# EAGLE design Arcade Kitchen Timer Mini (EAGLE 8.4.1)
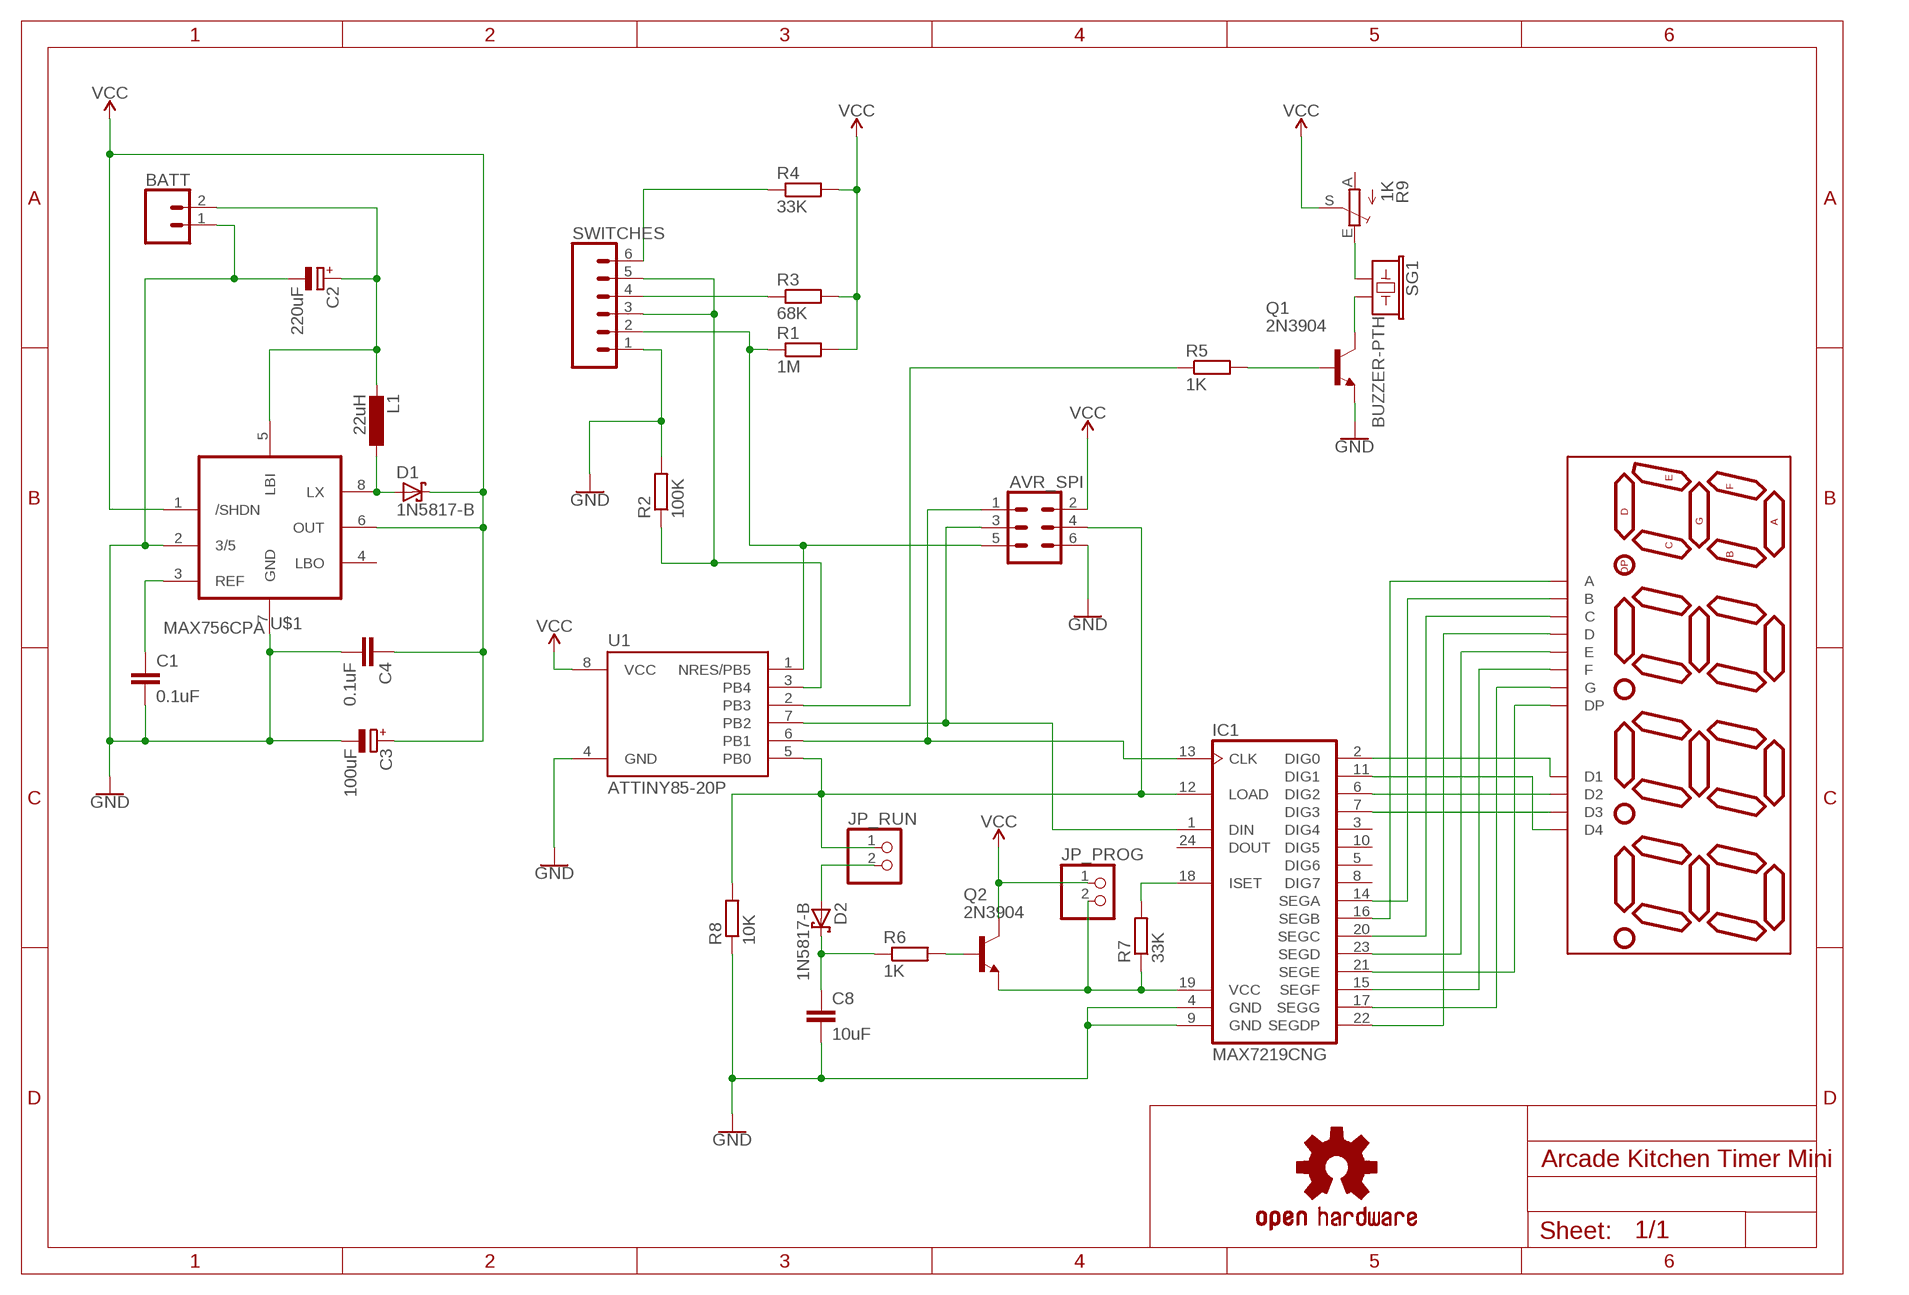
[diagram p0: schematic, sheet 1]

## Parts
AVR_SPI  CONN_03X2SHROUD  [2X3-SHROUDED]
BATT  CONN_02POLAR  [MOLEX-1X2]
C1  0.1uF  C-EU050-035X075  [C050-035X075]
C2  220uF  CPOL-EUE2.5-7  [E2,5-7]
C3  100uF  CPOL-EUE2.5-6  [E2,5-6]
C4  0.1uF  C-EU050-035X075  [C050-035X075]
C8  10uF  C-EU050-035X075  [C050-035X075]
D1  1N5817-B  [DO41-7.6]
D2  1N5817-B  [DO41-7.6]
DISP1  ATA8041ARBJ  7-SEGMENT-4DIGIT-20MM-RED  [7-SEGMENT-4DIGIT-20MM]
IC1  MAX7219CNG  [DIL24-3]
JP_PROG  PINHD-1X2  [1X02]
JP_RUN  PINHD-1X2  [1X02]
L1  22uH  L-EU6000-XXX-RC  [6000-XXXX-RC]
LOGO1  OSHW-LOGOM  [OSHW-LOGO-M]
Q1  2N3904  [TO92]
Q2  2N3904  [TO92]
R1  1M  R-EU_0207/10  [0207/10]
R2  100K  R-EU_0207/10  [0207/10]
R3  68K  R-EU_0207/10  [0207/10]
R4  33K  R-EU_0207/10  [0207/10]
R5  1K  R-EU_0207/10  [0207/10]
R6  1K  R-EU_0207/10  [0207/10]
R7  33K  R-EU_0207/10  [0207/10]
R8  10K  R-EU_0207/10  [0207/10]
R9  1K  TRIM_EU-B25P  [B25P]
SG1  BUZZER-PTH  [BUZZER-12MM]
SWITCHES  CONN_06POLAR  [MOLEX-1X6]
U1  ATTINY85-20P  [PDIP08_300MIL]
U$1  MAX756CPA  [DIL08]

## Nets
GND: AVR_SPI.6 BATT.1 C1.2 C2.- C3.- C4.2 C8.2 IC1.4(GND) IC1.9(GND) Q1.3(E) R2.2 R8.1 SWITCHES.1 U1.4(GND) U$1.2(3/5) U$1.7(GND)
N$1: D1.A L1.1 U$1.8(LX)
N$2: R5.1 U1.2(PB3)
N$3: R3.1 SWITCHES.4
N$4: Q1.2(B) R5.2
N$5: AVR_SPI.5 R1.1 SWITCHES.2 U1.1(NRES/PB5)
N$6: D2.A JP_RUN.2
N$7: R4.1 SWITCHES.6
N$8: Q2.2(B) R6.2
N$9: C1.1 U$1.3(REF)
N$10: Q1.1(C) SG1.-
N$11: R9.E SG1.+
N$12: AVR_SPI.3 IC1.1(DIN) U1.7(PB2)
N$13: IC1.18(ISET) R7.2
N$14: C8.1 D2.C R6.1
N$15: AVR_SPI.1 IC1.13(CLK) U1.6(PB1)
N$16: AVR_SPI.4 IC1.12(LOAD) JP_RUN.1 R8.2 U1.5(PB0)
N$17: IC1.19(VCC) JP_PROG.2 Q2.3(E) R7.1
N$18: DISP1.11(A) IC1.16(SEGB)
N$19: DISP1.7(B) IC1.14(SEGA)
N$20: DISP1.4(C) IC1.20(SEGC)
N$21: DISP1.2(D) IC1.22(SEGDP)
N$22: DISP1.1(E) IC1.23(SEGD)
N$23: DISP1.10(F) IC1.15(SEGF)
N$24: DISP1.5(G) IC1.17(SEGG)
N$25: DISP1.3(DP) IC1.21(SEGE)
N$26: DISP1.12(D1) IC1.2(DIG0)
N$27: DISP1.9(D2) IC1.6(DIG2)
N$28: DISP1.8(D3) IC1.7(DIG3)
N$29: DISP1.6(D4) IC1.11(DIG1)
N$32: BATT.2 C2.+ L1.2 U$1.5(LBI)
N$33: R2.1 SWITCHES.3 SWITCHES.5 U1.3(PB4)
VCC: AVR_SPI.2 C3.+ C4.1 D1.C JP_PROG.1 Q2.1(C) R1.2 R3.2 R4.2 R9.S U1.8(VCC) U$1.1(/SHDN) U$1.6(OUT)
Unconnected: IC1.3(DIG4) IC1.5(DIG6) IC1.8(DIG7) IC1.10(DIG5) IC1.24(DOUT) R9.A U$1.4(LBO)

## Library data of the parts
AVR_SPI = SparkFun-Connectors:CONN_03X2: Multi connection point. Often used as Generic Header-pin footprint for 0.1 inch spaced/style header connections You can populate with any combo of single row headers, but if you'd like an exact match, check these: Header - 2x3 (Male, 0.1") <https://www.sparkfun.com/products/12807> (PRT-12807) Header - 2x3 (Female, 0.1") <https://www.sparkfun.com/products/13010> (PRT-13010) 2x3 Pin Shrouded Header <https://www.sparkfun.com/products/10877> (PRT-10877) On any of the 0.1 inch spaced packages, you can populate with these: Break Away Headers - Straight <https://www.sparkfun.com/products/116> (PRT-00116) Break Away Male Headers - Right Angle <https://www.sparkfun.com/products/553> (PRT-00553) Female Headers <https://www.sparkfun.com/products/115> (PRT-00115) Break Away Headers - Machine Pin <https://www.sparkfun.com/products/117> (PRT-00117) Break Away Female Headers - Swiss Machine Pin <https://www.sparkfun.com/products/743> (PRT-00743) Special note: the shrouded connector mates well with our 3x2 ribbon cables: Ribbon Crimp Connector - 6-pin (2x3, Female) <https://www.sparkfun.com/products/10651> (PRT-10651) Ribbon Cable - 6 wire (15ft) <https://www.sparkfun.com/products/10646> (PRT-10646); PROD_ID: CONN-10681; SF_ID: PRT_10877
BATT = SparkFun-Connectors:CONN_02: Multi connection point. Often used as Generic Header-pin footprint for 0.1 inch spaced/style header connections On any of the 0.1 inch spaced packages, you can populate with these: Break Away Headers - Straight <https://www.sparkfun.com/products/116> (PRT-00116) Break Away Male Headers - Right Angle <https://www.sparkfun.com/products/553> (PRT-00553) Female Headers <https://www.sparkfun.com/products/115> (PRT-00115) Break Away Headers - Machine Pin <https://www.sparkfun.com/products/117> (PRT-00117) Break Away Female Headers - Swiss Machine Pin <https://www.sparkfun.com/products/743> (PRT-00743) For SCREWTERMINALS and SPRING TERMINALS visit here: Screw Terimnals on SparkFun.com <https://www.sparkfun.com/search/results?term=Screw+Terminals> (5mm/3.5mm/2.54mm spacing) This device is also useful as a general connection point to wire up your design to another part of your project. Our various solder wires solder well into these plated through hole pads. Hook-Up Wire - Assortment (Stranded, 22 AWG) <https://www.sparkfun.com/products/11375> (PRT-11375) Hook-Up Wire - Assortment (Solid Core, 22 AWG) <https://www.sparkfun.com/products/11367> (PRT-11367) View the entire wire category on our website here <https://www.sparkfun.com/categories/141> Special notes: Molex polarized connector foot print use with: PRT-08233 with associated crimp pins and housings. 2.54_SCREWTERM for use with PRT-10571. 3.5mm Screw Terminal footprints for PRT-08084 5mm Screw Terminal footprints for use with PRT-08432; SF_ID: PRT-09918
C1 C4 C8 = resistor:C-EU: CAPACITOR, European symbol
C2 C3 = resistor:CPOL-EU: POLARIZED CAPACITOR, European symbol
D1 D2 = diode:1N581*: 1.0A SCHOTTKY BARRIER RECTIFIER Source: http://www.diodes.com/datasheets/ds23001.pdf
DISP1 = SparkFun-LED:7-SEGMENT-4DIGIT-20MM: 4 Digit 7 Segment Display This is a part for the 4-Digit 7-segment LEDs from Young Sun. Different from the Digikey LEDs, all 16 pins are used. The LONGPADS Variant is used for a test jig, but you may like it because there is more pad to solder to. If you are concerned about routing space, the standard works just fine though. Datasheets: Red <http://cdn.sparkfun.com/datasheets/Components/LED/1LEDREDCC.pdf> Yellow <http://cdn.sparkfun.com/datasheets/Components/LED/1LEDYELCC.pdf> Green <http://cdn.sparkfun.com/datasheets/Components/LED/1LEDGRNCC.pdf> Blue <http://cdn.sparkfun.com/datasheets/Components/LED/1LEDBLUCC.pdf> White <http://cdn.sparkfun.com/datasheets/Components/LED/1LEDWHTCC.pdf> SparkFun Products Raw Components 7-Segment Display - 20mm (Red) <https://www.sparkfun.com/products/11405> (COM-11405) 7-Segment Display - 20mm (Yellow) <https://www.sparkfun.com/products/11406> (COM-11406) 7-Segment Display - 20mm (Green) <https://www.sparkfun.com/products/11407> (COM-11407) 7-Segment Display - 20mm (Blue) <https://www.sparkfun.com/products/11408> (COM-11408) 7-Segment Display - 20mm (White) <https://www.sparkfun.com/products/11409> (COM-11409) Serial Controlled SparkFun OpenSegment Serial Display - 20mm (Red) <https://www.sparkfun.com/products/11644> (COM-11644) SparkFun OpenSegment Serial Display - 20mm (Yellow) <https://www.sparkfun.com/products/11645> (COM-11645) SparkFun OpenSegment Serial Display - 20mm (Green) <https://www.sparkfun.com/products/11646> (COM-11646) SparkFun OpenSegment Serial Display - 20mm (Blue) <https://www.sparkfun.com/products/11647> (COM-11647) SparkFun OpenSegment Serial Display - 20mm (White) <https://www.sparkfun.com/products/11648> (COM-11648) Other SparkFun OpenSegment Shield <https://www.sparkfun.com/products/13190> (DEV-13190); PROD_ID: COMP-11449
IC1 = maxim:MAX7219CNG: LED DISPLAY DRIVER; MF: MAXIM; MPN: MAX7219CNG; OC_FARNELL: 1523914; OC_NEWARK: 34C4018
JP_PROG JP_RUN = pinhead:PINHD-1X2: PIN HEADER
L1 = rcl:L-EU: INDUCTOR, European symbol
LOGO1 = SparkFun-Aesthetics:OSHW-LOGO: Open-Source Hardware (OSHW) Logo This logo indicates the piece of hardware it is found on incorporates a OSHW license and/or adheres to the definition of open source hardware found here: http://freedomdefined.org/OSHW
Q1 Q2 = transistor-npn:2N3904: NPN Transistor
R1-R8 = resistor:R-EU_: RESISTOR, European symbol
R9 = pot:TRIM_EU-: POTENTIOMETER
SG1 = SparkFun-Electromechanical:BUZZER: Buzzer Small round buzzers that operate around the audible 2kHz range. You can use these as speakers to create simple music or user interfaces. Variant Overview: PTH - Mini Speaker - PC Mount 12mm 2.048kHz <https://www.sparkfun.com/products/7950> PTH_KIT - Mini Speaker - PC Mount 12mm 2.048kHz <https://www.sparkfun.com/products/7950> KIT simplifies soldering by adding stop mask to one side of the pads. PTH_NO_SILK - Mini Speaker - PC Mount 12mm 2.048kHz <https://www.sparkfun.com/products/7950> No silkscreen indicator of buzzer outline. PTH_KIT_NO_SILK - Mini Speaker - PC Mount 12mm 2.048kHz <https://www.sparkfun.com/products/7950> KIT package w/o silkscreen SMD - Buzzer Audio Magnetic (CCV-084B16) SMD buzzer used on, e.g. the LilyPad Buzzer <https://www.sparkfun.com/products/8463> and RFID USB Reader <https://www.sparkfun.com/products/9963>. SMD_KIT - Buzzer Audio Magnetic (CCV-084B16) SMD Buzzer with elongated pins to make soldering easier. Used on the SparkFun Simon Says - Surface Mount Soldering Kit <https://www.sparkfun.com/products/10935>.; PROD_ID: COMP-08253; SF_SKU: COM-07950
SWITCHES = SparkFun-Connectors:CONN_06: Multi connection point. Often used as Generic Header-pin footprint for 0.1 inch spaced/style header connections On any of the 0.1 inch spaced packages, you can populate with these: Break Away Headers - Straight <https://www.sparkfun.com/products/116> (PRT-00116) Break Away Male Headers - Right Angle <https://www.sparkfun.com/products/553> (PRT-00553) Female Headers <https://www.sparkfun.com/products/115> (PRT-00115) Break Away Headers - Machine Pin <https://www.sparkfun.com/products/117> (PRT-00117) Break Away Female Headers - Swiss Machine Pin <https://www.sparkfun.com/products/743> (PRT-00743) Arduino Stackable Header - 6 Pin <https://www.sparkfun.com/products/9280> (PRT-09280) For SCREWTERMINALS and SPRING TERMINALS visit here: Screw Terimnals on SparkFun.com <https://www.sparkfun.com/search/results?term=Screw+Terminals> (5mm/3.5mm/2.54mm spacing) This device is also useful as a general connection point to wire up your design to another part of your project. Our various solder wires solder well into these plated through hole pads. Hook-Up Wire - Assortment (Stranded, 22 AWG) <https://www.sparkfun.com/products/11375> (PRT-11375) Hook-Up Wire - Assortment (Solid Core, 22 AWG) <https://www.sparkfun.com/products/11367> (PRT-11367) View the entire wire category on our website here <https://www.sparkfun.com/categories/141>
U1 = _hhn_attiny25_45_85:ATTINY85*: ATMEL ATtiny 85 Packages: P = PDIP 08 30mil S = SOIC 08 EIAJ 208mil Technologies Note: for complete ordering code (temp. range, finish, tape&reel etc.) see www.atmel.com • Supply Voltage: V = (1.8…5.5)V | [blank] = (2.7…5.5)V • Speed: 10 = 10 MHz | 20 = 20 MHz Author: Dipl.-Ing. FH Rainer Bayer HHN Hochschule Heilbronn (Heilbronn University), rainer.bayer@hs-heilbronn.de Ingenieurbüro ing-rb, mail@ing-rb.de
U$1 = adafruit:MAX756

## Net classes
0 default: width 0.406 mm, drill 0.254 mm, clearance 0.205 mm

## Board
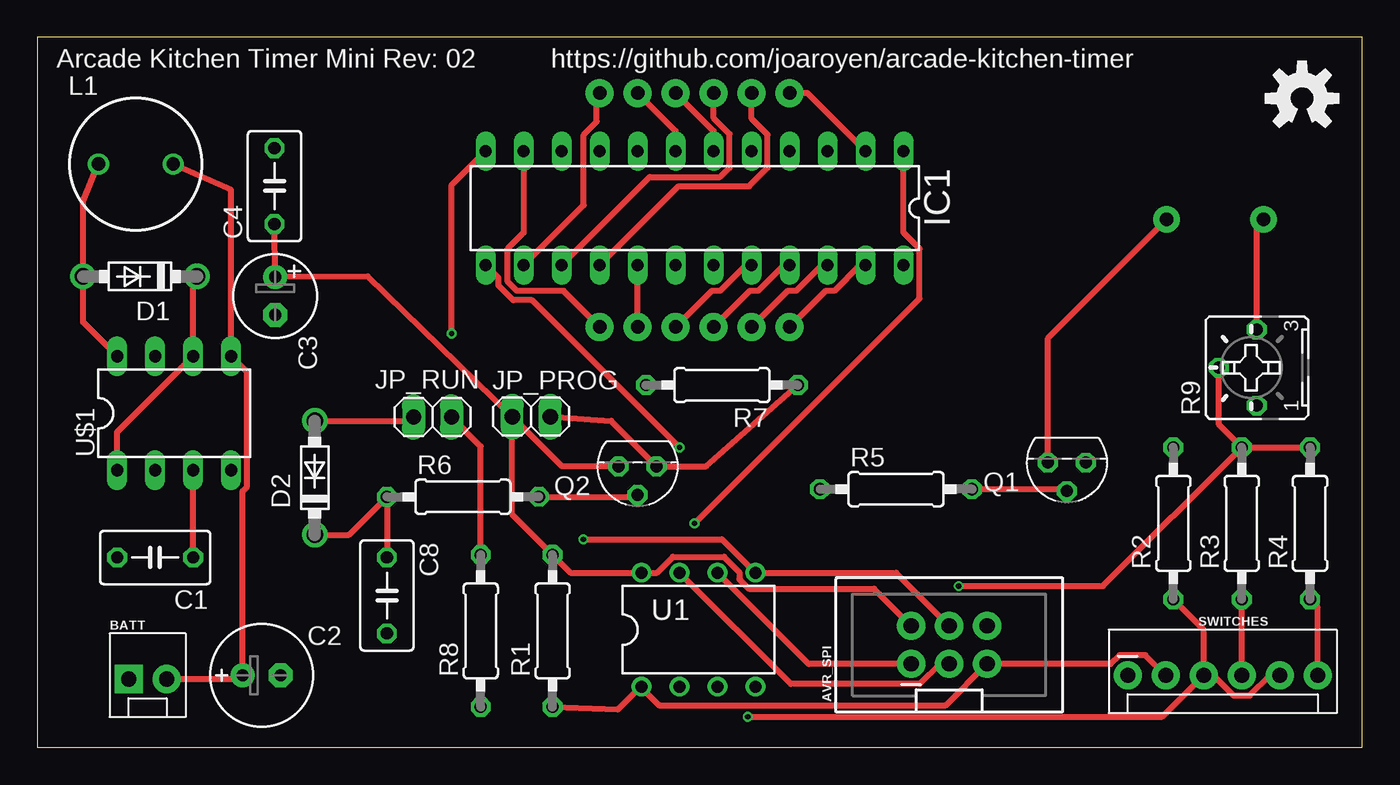
[diagram p1: board, top side]
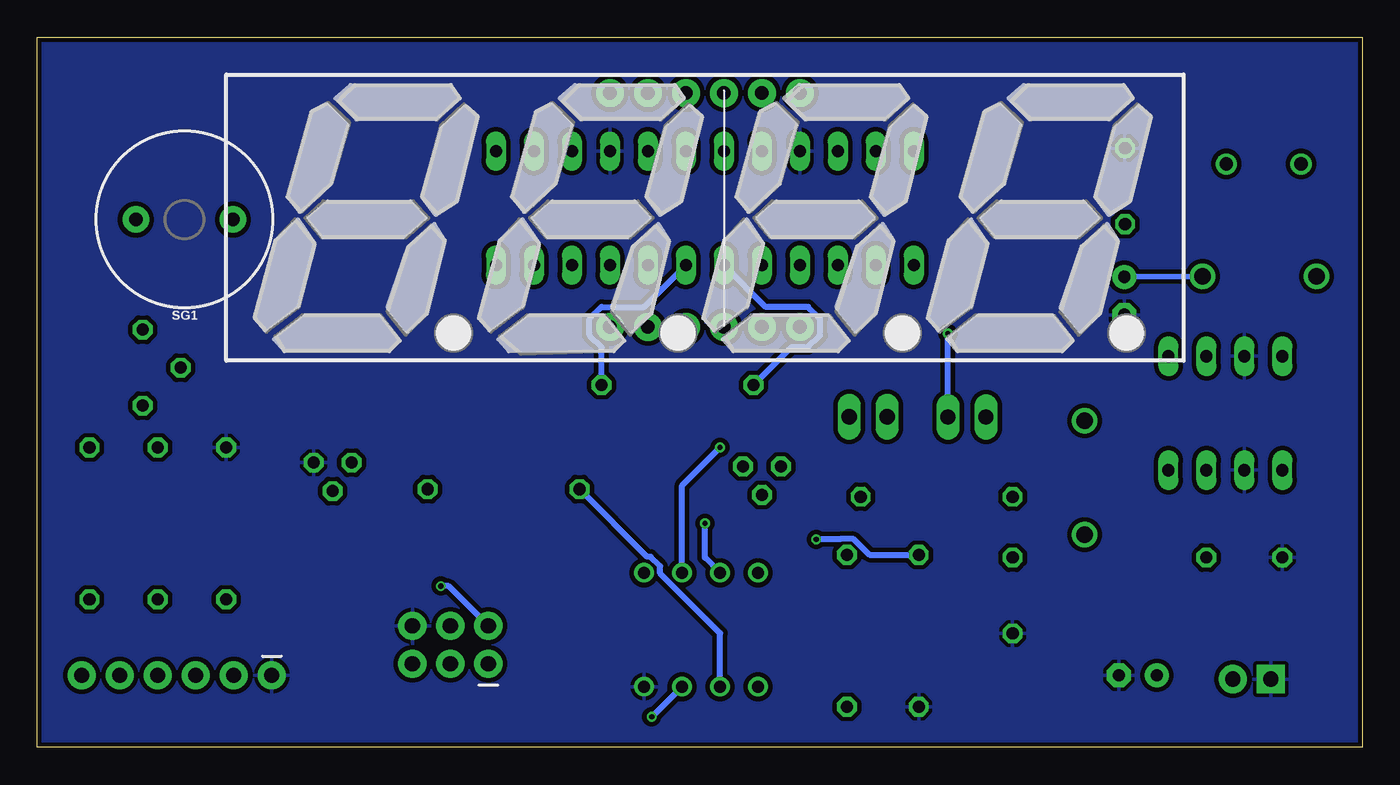
[diagram p2: board, bottom side, seen from below]

Size 88.57 x 47.49 mm. Coordinates in mm from the lower left corner, seen from the top.
Outline: 0,0 88.57,0 88.57,47.49 0,47.49 0,0
Copper layers (1*16): Top 0.035mm / dielectric 1.5mm / Bottom 0.035mm
Design rules "dirt_cheap_dirty_boards.v1": minimum track width 5mil, minimum drill 12mil, track to track 5mil, track to pad 5mil, pad to pad 5mil, via to via 5mil, smd to smd 0mil, copper to edge 10mil, drill to drill 10mil, minimum pad ring 10mil, minimum via ring 6mil, stop-mask expansion 2mil, vias tented up to drill 25mil, thermal gap 10mil

### Footprints (pad centres in the part's own frame; a part is rotated, then mirrored left to right if it is on the bottom)
2X3-SHROUDED = drill 1.016 pad 1.88: 1 -1.27,2.54; 2 1.27,2.54; 3 -1.27,0; 4 1.27,0; 5 -1.27,-2.54; 6 1.27,-2.54
MOLEX-1X2 = drill 1.016 pad 1.88 square: 1 0,0 | drill 1.016 pad 1.88: 2 2.54,0
C050-035X075 = drill 0.813 octagon: 1 -2.54,0; 2 2.54,0
E2,5-7 = drill 0.813 pad 1.6: + -1.27,0 | drill 0.813 pad 1.6 octagon: - 1.27,0
E2,5-6 = drill 0.813 pad 1.6: + -1.27,0 | drill 0.813 pad 1.6 octagon: - 1.27,0
DO41-7.6 = drill 1.1 pad 1.7: A 3.81,0; C -3.81,0
7-SEGMENT-4DIGIT-20MM = drill 0.9 pad 1.88: 1 -6.35,-4.648; 2 -3.81,-4.648; 3 -1.27,-4.648; 4 1.27,-4.648; 5 3.81,-4.648; 6 6.35,-4.648; 7 6.35,10.998; 8 3.81,10.998; 9 1.27,10.998; 10 -1.27,10.998; 11 -3.81,10.998; 12 -6.35,10.998
DIL24-3 = drill 0.813 long: 1 -13.97,-3.81; 2 -11.43,-3.81; 3 -8.89,-3.81; 4 -6.35,-3.81; 5 -3.81,-3.81; 6 -1.27,-3.81; 7 1.27,-3.81; 8 3.81,-3.81; 9 6.35,-3.81; 10 8.89,-3.81; 11 11.43,-3.81; 12 13.97,-3.81; 13 13.97,3.81; 14 11.43,3.81; 15 8.89,3.81; 16 6.35,3.81; 17 3.81,3.81; 18 1.27,3.81; 19 -1.27,3.81; 20 -3.81,3.81; 21 -6.35,3.81; 22 -8.89,3.81; 23 -11.43,3.81; 24 -13.97,3.81
1X02 = drill 1.016 long: 1 -1.27,0; 2 1.27,0
6000-XXXX-RC = drill 0.9 pad 1.422: 1 -2.5,0; 2 2.5,0
TO92 = drill 0.813 octagon: 1 1.27,0; 2 0,1.905; 3 -1.27,0
0207/10 = drill 0.813 octagon: 1 -5.08,0; 2 5.08,0
B25P = drill 0.813 octagon: A -2.54,0; E 2.54,0; S 0,2.54
BUZZER-12MM = drill 0.9 pad 1.778: + 3.25,0; - -3.25,0
MOLEX-1X6 = drill 1.016 pad 1.88: 1 0,0; 2 2.54,0; 3 5.08,0; 4 7.62,0; 5 10.16,0; 6 12.7,0
PDIP08_300MIL = drill 0.813: 1 -3.81,-3.81; 2 -1.27,-3.81; 3 1.27,-3.81; 4 3.81,-3.81; 5 3.81,3.81; 6 1.27,3.81; 7 -1.27,3.81; 8 -3.81,3.81
DIL08 = drill 0.813 long: 1 -3.81,-3.81; 2 -1.27,-3.81; 3 1.27,-3.81; 4 3.81,-3.81; 5 3.81,3.81; 6 1.27,3.81; 7 -1.27,3.81; 8 -3.81,3.81

### Placement (x,y rotation side)
AVR_SPI  60.96,6.86 90 top
BATT  6.1,4.57 0 top
C1  7.87,12.7 180 top
C2  14.99,4.83 0 top
C3  15.9,30.2 270 top
C4  15.85,37.54 90 top
C8  23.37,10.16 270 top
D1  6.86,31.5 180 top
D2  18.54,18.03 90 top
DISP1  43.94,32.77 0 bottom
IC1  43.94,36.07 180 top
JP_PROG  33.02,22.12 0 top
JP_RUN  26.42,22.1 180 top
L1  6.58,39.01 0 top
LOGO1  84.56,43.41 0 top
Q1  68.83,19.05 180 top
Q2  40.13,18.8 180 top
R1  34.44,7.8 90 top
R2  75.95,14.99 90 top
R3  80.52,14.99 90 top
R4  85.09,14.99 90 top
R5  57.4,17.27 0 top
R6  28.45,16.76 0 top
R7  45.77,24.23 180 top
R8  29.64,7.8 90 top
R9  81.53,25.4 90 top
SG1  78.74,35.31 180 bottom
SWITCHES  72.9,4.83 0 top
U1  44.2,7.87 0 top
U$1  9.14,22.35 0 top

### Tracks (layer width: path | path; a pad name or v marks a point on that pad's centre or on a via)
GND
  pour Bottom (isolate 0.305): 0.25,47.24 88.39,47.24 88.39,0 0.25,0
N$1
  Top 0.406: U$1.8 3.05,28.45 D1.A 3.05,36.54 L1.1
N$2
  Bottom 0.406: R5.1 47.8,12.75 47.56,12.75 46.94,12.13 46.94,11.64 42.93,7.63 U1.2
N$3
  Top 0.406: SWITCHES.4 R3.1
N$4
  Top 0.406: R5.2 68.71,17.27 Q1.2
N$5
  Top 0.406: 40.33,4.05 U1.1 | SWITCHES.2 74.09,6.17 72.34,6.17 71.75,5.59 AVR_SPI.5 60.71,2.79 41.58,2.79 40.33,4.05 | R1.1 38.82,2.54 40.33,4.05
N$6
  Top 0.406: D2.A 24.89,21.84 JP_RUN.2
N$7
  Top 0.406: SWITCHES.6 85.6,9.4 R4.1
N$8
  Top 0.406: R6.2 40,16.76 Q2.2
N$9
  Top 0.406: C1.1 U$1.3
N$10
  Top 0.406: Q1.1 67.56,27.38 SG1.-
N$11
  Top 0.406: R9.E 81.53,34.85 SG1.+
N$12  (via drill 0.35)
  Top 0.406: AVR_SPI.3 60.33,5.59 58.98,4.24 50.37,4.24 U1.7 | IC1.1 57.91,34.43 58.98,33.36 58.98,30.03 v43.94,14.99
  Bottom 0.406: U1.7 43.94,12.7 v43.94,14.99
N$13
  Bottom 0.406: IC1.18 39.88,29.47 37.03,29.47 36.24,28.68 36.24,27.56 37.03,26.77 38.15,26.77 R7.2
N$14
  Top 0.406: C8.1 R6.1 20.83,14.22 D2.C
N$15  (via drill 0.35)
  Top 0.406: AVR_SPI.1 51.56,5.59 U1.6 | v42.93,20.07 33.07,29.92 31.82,29.92 30.83,30.9 30.83,31.4 IC1.13
  Bottom 0.406: U1.6 45.47,17.53 v42.93,20.07
N$16  (via drill 0.35)
  Top 0.406: v27.69,27.69 27.69,37.59 IC1.12 | R8.2 29.64,20.14 JP_RUN.1 | v36.5,13.92 45.77,13.92 U1.5 57.4,11.68 AVR_SPI.4
  Bottom 0.406: JP_RUN.1 v27.69,27.69 | R8.2 32.93,12.88 34,13.95 34.88,13.95 34.91,13.92 v36.5,13.92
N$17
  Top 0.406: JP_PROG.2 38.35,21.84 Q2.3 44.7,18.8 R7.1
  Bottom 0.406: IC1.19 48,29.47 50.85,29.47 51.64,28.68 51.64,27.56 50.85,26.77 R7.1
N$18
  Top 0.406: IC1.16 42.87,37.54 47.58,37.54 48.82,38.77 48.82,40.98 47.75,42.05 DISP1.11
N$19
  Top 0.406: DISP1.7 37.4,43.71 37.4,41.85 36.52,40.98 36.52,36.27 IC1.14
N$20
  Top 0.406: DISP1.4 45.08,30.53 45.65,30.53 47.38,32.26 IC1.20
N$21
  Top 0.406: DISP1.2 50.16,30.53 50.73,30.53 52.46,32.26 IC1.22
N$22
  Top 0.406: DISP1.1 52.7,30.53 53.27,30.53 55,32.26 IC1.23
N$23
  Top 0.406: IC1.15 40.94,38.15 45.65,38.15 46.28,38.77 46.28,41.02 45.21,42.09 DISP1.10
N$24
  Top 0.406: DISP1.5 IC1.17
N$25
  Top 0.406: DISP1.3 47.62,30.53 48.2,30.53 49.92,32.26 IC1.21
N$26
  Top 0.406: IC1.2 51.49,43.76 DISP1.12
N$27
  Top 0.406: IC1.6 45.21,41.22 DISP1.9
N$28
  Top 0.406: IC1.7 42.67,41.22 DISP1.8
N$29
  Top 0.406: DISP1.6 35.18,30.53 32.07,30.53 31.44,31.15 31.44,33.36 32.51,34.43 IC1.11
N$32
  Top 0.406: L1.2 12.95,37.3 U$1.5 14.02,25.09 14.02,17.44 13.72,17.13 C2.+ 13.46,4.57 BATT.2
N$33  (via drill 0.35)
  Top 0.406: SWITCHES.3 78.61,4.83 79.96,3.48 81.08,3.48 82.42,4.83 SWITCHES.5 | SWITCHES.3 77.98,7.87 R2.1 | v47.5,2.06 75.21,2.06 SWITCHES.3
  Bottom 0.406: U1.3 47.47,2.06 v47.5,2.06
VCC  (via drill 0.35)
  Top 0.406: C4.1 C3.+ 22.1,31.5 JP_PROG.1 | R3.2 R4.2 | U$1.1 5.33,21.08 U$1.6 10.41,31.24 D1.C | R3.2 78.99,21.59 R9.S | JP_PROG.1 31.75,15.57 R1.2 35.64,11.68 U1.8 41.41,11.68 42.48,12.75 45.91,12.75 46.94,11.72 46.94,11.24 47.56,10.61 55.93,10.61 AVR_SPI.2 | Q2.1 35.08,18.8 JP_PROG.1 | v61.59,10.79 71.25,10.79 R3.2
  Bottom 0.406: D1.C C3.+ | AVR_SPI.2 61.09,10.79 v61.59,10.79

### Text on the board
tPlace: Arcade Kitchen Timer Mini Rev: 02 https://github.com/joaroyen/arcade-kitchen-timer